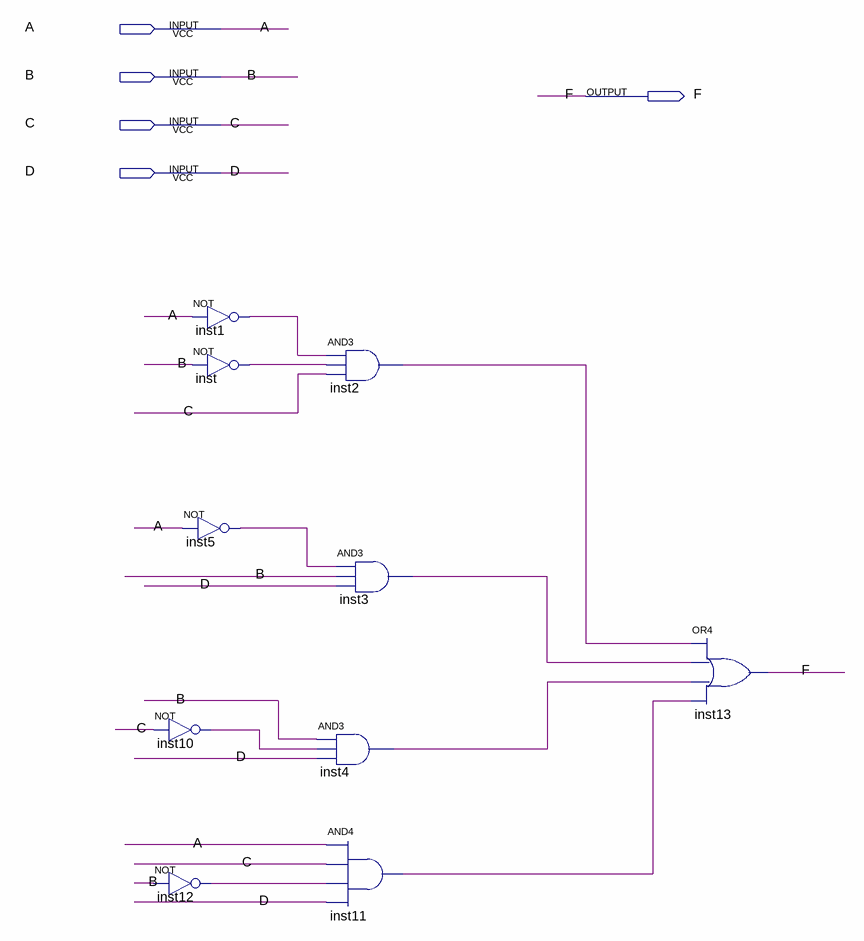
[diagram p0: schematic sheet]
// Quartus schematic prime.bdf as structural Verilog: 10 symbols, 5 pins
module prime (
  input  A,
  input  B,
  input  C,
  input  D,
  output F
);

  wire inst1_out, inst2_out, inst3_out, inst4_out, inst5_out, inst10_out, inst11_out, inst12_out, inst_out;

  not inst5 (inst5_out, A);
  not inst10 (inst10_out, C);
  not inst12 (inst12_out, B);
  not inst1 (inst1_out, A);
  not inst (inst_out, B);
  and inst2 (inst2_out, inst1_out, inst_out, C);
  and inst3 (inst3_out, inst5_out, B, D);
  and inst4 (inst4_out, B, inst10_out, D);
  and inst11 (inst11_out, A, C, inst12_out, D);
  or inst13 (F, inst2_out, inst3_out, inst4_out, inst11_out);
endmodule
